# Altium project final-project.PrjPCB
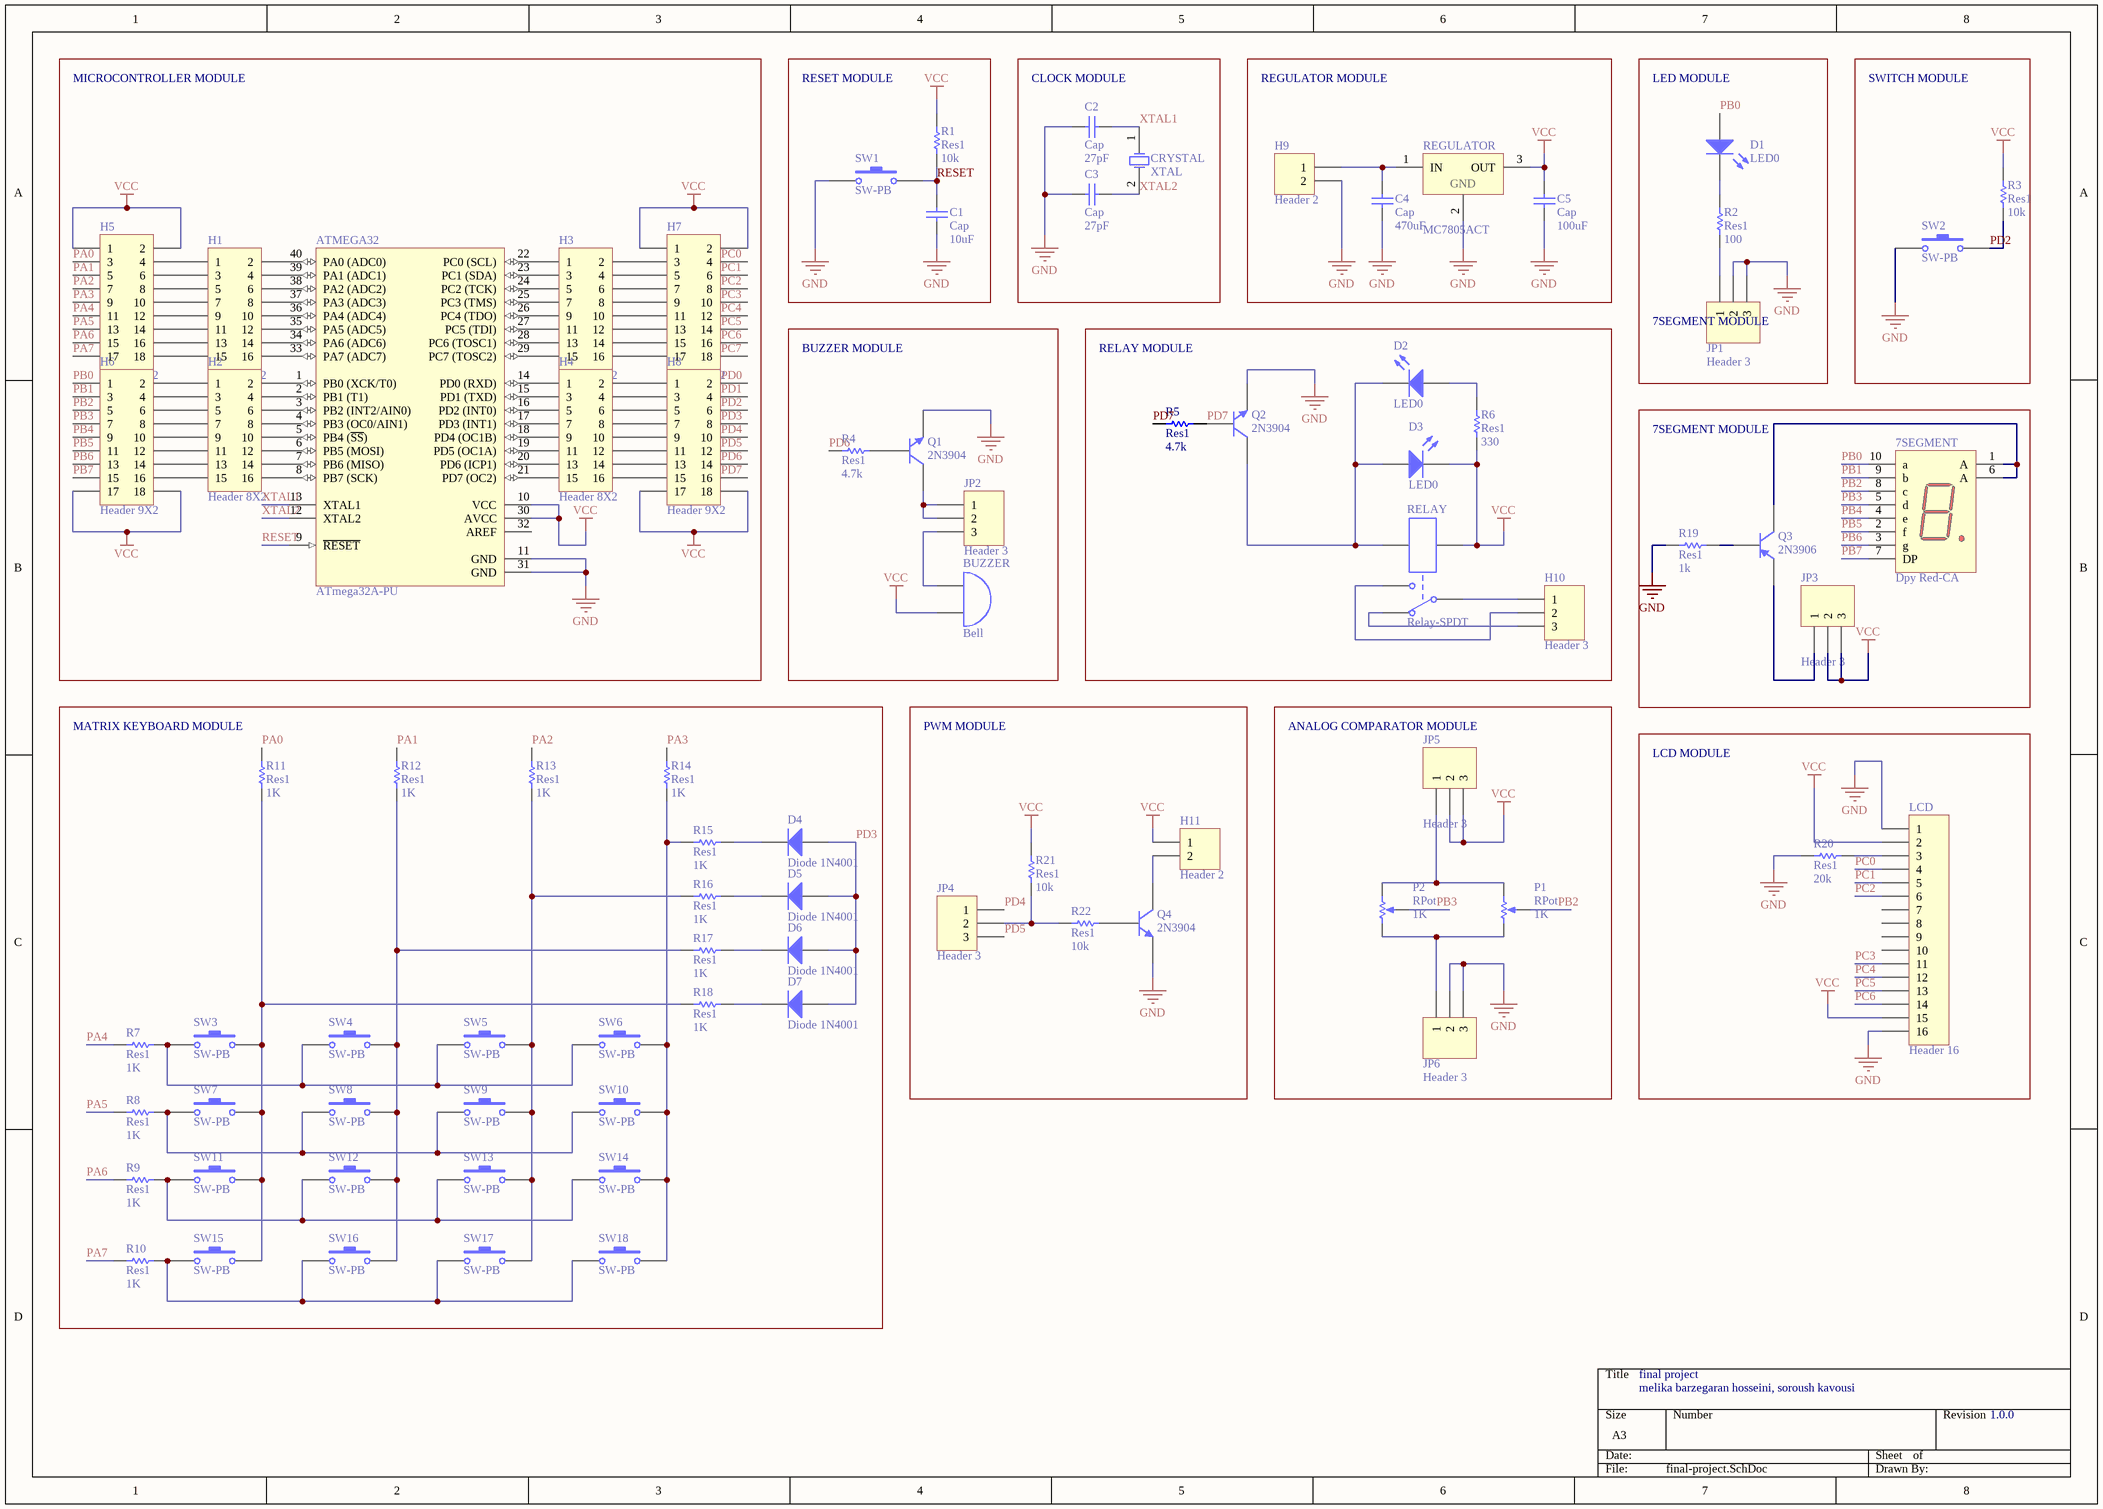
[diagram p0: final-project.SchDoc]
1 sheet, 82 parts. Net scope: global (net labels, ports and power ports of the same name join across sheets).
Board file: final-project.PcbDoc

## Sheet final-project.SchDoc: final project
size A3; Author: melika barzegaran hosseini, soroush kavousi; Revision: 1.0.0

### Parts
7SEGMENT  Dpy Red-CA  [LEDDIP-10/C5.08RHD]
ATMEGA32  ATmega32A-PU  [40P6]
BUZZER  Bell  [PIN2]
C1  Cap  value 10uF  [RAD-0.3]
C2  Cap  value 27pF  [RAD-0.3]
C3  Cap  value 27pF  [RAD-0.3]
C4  Cap  value 470uF  [RAD-0.3]
C5  Cap  value 100uF  [RAD-0.3]
CRYSTAL  XTAL  [BCY-W2/D3.1]
D1  LED0  [RB5-10.5]
D2  LED0  [RB5-10.5]
D3  LED0  [RB5-10.5]
D4  Diode 1N4001  [DIO10.46-5.3x2.8]
D5  Diode 1N4001  [DIO10.46-5.3x2.8]
D6  Diode 1N4001  [DIO10.46-5.3x2.8]
D7  Diode 1N4001  [DIO10.46-5.3x2.8]
H1  Header 8X2  [HDR1X8]
H2  Header 8X2  [HDR1X8]
H3  Header 8X2  [HDR1X8]
H4  Header 8X2  [HDR1X8]
H5  Header 9X2  [HDR1X9]
H6  Header 9X2  [HDR1X9]
H7  Header 9X2  [HDR1X9]
H8  Header 9X2  [HDR1X9]
H9  Header 2  [HDR1X2]
H10  Header 3  [HDR1X3]
H11  Header 2  [HDR1X2]
JP1  Header 3  [HDR1X3]
JP2  Header 3  [HDR1X3]
JP3  Header 3  [HDR1X3]
JP4  Header 3  [HDR1X3]
JP5  Header 3  [HDR1X3]
JP6  Header 3  [HDR1X3]
LCD  Header 16  [HDR1X16]
P1  RPot  value 1K  [VR5]
P2  RPot  value 1K  [VR5]
Q1  2N3904  [HDR1X3]
Q2  2N3904  [HDR1X3]
Q3  2N3906  [HDR1X3]
Q4  2N3904  [HDR1X3]
R1  Res1  value 10k  [AXIAL-0.3]
R2  Res1  value 100  [AXIAL-0.3]
R3  Res1  value 10k  [AXIAL-0.3]
R4  Res1  value 4.7k  [AXIAL-0.3]
R5  Res1  value 4.7k  [AXIAL-0.3]
R6  Res1  value 330  [AXIAL-0.3]
R7  Res1  value 1K  [AXIAL-0.3]
R8  Res1  value 1K  [AXIAL-0.3]
R9  Res1  value 1K  [AXIAL-0.3]
R10  Res1  value 1K  [AXIAL-0.3]
R11  Res1  value 1K  [AXIAL-0.3]
R12  Res1  value 1K  [AXIAL-0.3]
R13  Res1  value 1K  [AXIAL-0.3]
R14  Res1  value 1K  [AXIAL-0.3]
R15  Res1  value 1K  [AXIAL-0.3]
R16  Res1  value 1K  [AXIAL-0.3]
R17  Res1  value 1K  [AXIAL-0.3]
R18  Res1  value 1K  [AXIAL-0.3]
R19  Res1  value 1k  [AXIAL-0.3]
R20  Res1  value 20k  [AXIAL-0.3]
R21  Res1  value 10k  [AXIAL-0.3]
R22  Res1  value 10k  [AXIAL-0.3]
REGULATOR  MC7805ACT  [221A-04]
RELAY  Relay-SPDT  [DIP-P5/X1.65]
SW1  SW-PB  [SPST-2]
SW2  SW-PB  [SPST-2]
SW3  SW-PB  [SPST-2]
SW4  SW-PB  [SPST-2]
SW5  SW-PB  [SPST-2]
SW6  SW-PB  [SPST-2]
SW7  SW-PB  [SPST-2]
SW8  SW-PB  [SPST-2]
SW9  SW-PB  [SPST-2]
SW10  SW-PB  [SPST-2]
SW11  SW-PB  [SPST-2]
SW12  SW-PB  [SPST-2]
SW13  SW-PB  [SPST-2]
SW14  SW-PB  [SPST-2]
SW15  SW-PB  [SPST-2]
SW16  SW-PB  [SPST-2]
SW17  SW-PB  [SPST-2]
SW18  SW-PB  [SPST-2]

### Blocks framed on the sheet
MICROCONTROLLER MODULE: ATMEGA32 H1-H8
RESET MODULE: C1 R1 SW1
CLOCK MODULE: C2 C3 CRYSTAL
REGULATOR MODULE: C4 C5 H9 REGULATOR
SWITCH MODULE: R3 SW2
BUZZER MODULE: BUZZER JP2 Q1 R4
RELAY MODULE: D2 D3 H10 Q2 R5 R6 RELAY
7SEGMENT MODULE: 7SEGMENT JP3 Q3 R19
MATRIX KEYBOARD MODULE: D4-D7 R7-R18 SW3-SW18
PWM MODULE: H11 JP4 Q4 R21 R22
ANALOG COMPARATOR MODULE: JP5 JP6 P1 P2
LCD MODULE: LCD R20

### Nets
GND: ATMEGA32.11(GND) ATMEGA32.31(GND) C1.1 C2.1 C3.1 C4.1 C5.1 H9.2 JP1.2 JP1.3 JP6.2 JP6.3 LCD.1 LCD.16 Q1.1(E) Q2.1(E) Q4.1(E) R19.1 R20.1 REGULATOR.2(GND) SW1.1 SW2.1
VCC: ATMEGA32.10(VCC) ATMEGA32.30(AVCC) BUZZER.2(B) C5.2 D3.2(K) H5.1 H5.2 H6.17 H6.18 H7.1 H7.2 H8.17 H8.18 H11.1 JP3.2 JP3.3 JP5.2 JP5.3 LCD.2 LCD.15 R1.2 R3.2 R6.1 R21.2 REGULATOR.3(OUT) RELAY.4
PA0: H5.3 R11.2
PA1: H5.5 R12.2
PA2: H5.7 R13.2
PA3: H5.9 R14.2
PA4: H5.11 R7.1
PA5: H5.13 R8.1
PA6: H5.15 R9.1
PA7: H5.17 R10.1
PB0: 7SEGMENT.10(a) D1.1(A) H6.1
PB1: 7SEGMENT.9(b) H6.3
PB2: 7SEGMENT.8(c) H6.5 P1.3(TAP)
PB3: 7SEGMENT.5(d) H6.7 P2.3(TAP)
PB4: 7SEGMENT.4(e) H6.9
PB5: 7SEGMENT.2(f) H6.11
PB6: 7SEGMENT.3(g) H6.13
PB7: 7SEGMENT.7(DP) H6.15
PC0: LCD.4
PC1: LCD.5
PC2: LCD.6
PC3: LCD.11
PC4: LCD.12
PC5: LCD.13
PC6: LCD.14
PD2: R3.1 SW2.2
PD3: D4.1(A) D5.1(A) D6.1(A) D7.1(A)
PD4: JP4.1
PD5: JP4.3
PD6: R4.1
PD7: Q2.2(B) R5.1 R5.2
RESET: ATMEGA32.9(~{RESET}) C1.2 R1.1 SW1.2
XTAL1: ATMEGA32.13(XTAL1) C2.2 CRYSTAL.1(OSC1)
XTAL2: ATMEGA32.12(XTAL2) C3.2 CRYSTAL.2(OSC2)
Net7SEGMENT_1: 7SEGMENT.1(A) 7SEGMENT.6(A) Q3.3(C)
NetATMEGA32_1: ATMEGA32.1(PB0_(XCK/T0)) H2.2
NetATMEGA32_2: ATMEGA32.2(PB1_(T1)) H2.4
NetATMEGA32_3: ATMEGA32.3(PB2_(INT2/AIN0)) H2.6
NetATMEGA32_4: ATMEGA32.4(PB3_(OC0/AIN1)) H2.8
NetATMEGA32_5: ATMEGA32.5(PB4_(~{SS})) H2.10
NetATMEGA32_6: ATMEGA32.6(PB5_(MOSI)) H2.12
NetATMEGA32_7: ATMEGA32.7(PB6_(MISO)) H2.14
NetATMEGA32_8: ATMEGA32.8(PB7_(SCK)) H2.16
NetATMEGA32_14: ATMEGA32.14(PD0_(RXD)) H4.1
NetATMEGA32_15: ATMEGA32.15(PD1_(TXD)) H4.3
NetATMEGA32_16: ATMEGA32.16(PD2_(INT0)) H4.5
NetATMEGA32_17: ATMEGA32.17(PD3_(INT1)) H4.7
NetATMEGA32_18: ATMEGA32.18(PD4_(OC1B)) H4.9
NetATMEGA32_19: ATMEGA32.19(PD5_(OC1A)) H4.11
NetATMEGA32_20: ATMEGA32.20(PD6_(ICP1)) H4.13
NetATMEGA32_21: ATMEGA32.21(PD7_(OC2)) H4.15
NetATMEGA32_22: ATMEGA32.22(PC0_(SCL)) H3.1
NetATMEGA32_23: ATMEGA32.23(PC1_(SDA)) H3.3
NetATMEGA32_24: ATMEGA32.24(PC2_(TCK)) H3.5
NetATMEGA32_25: ATMEGA32.25(PC3_(TMS)) H3.7
NetATMEGA32_26: ATMEGA32.26(PC4_(TDO)) H3.9
NetATMEGA32_27: ATMEGA32.27(PC5_(TDI)) H3.11
NetATMEGA32_28: ATMEGA32.28(PC6_(TOSC1)) H3.13
NetATMEGA32_29: ATMEGA32.29(PC7_(TOSC2)) H3.15
NetATMEGA32_33: ATMEGA32.33(PA7_(ADC7)) H1.16
NetATMEGA32_34: ATMEGA32.34(PA6_(ADC6)) H1.14
NetATMEGA32_35: ATMEGA32.35(PA5_(ADC5)) H1.12
NetATMEGA32_36: ATMEGA32.36(PA4_(ADC4)) H1.10
NetATMEGA32_37: ATMEGA32.37(PA3_(ADC3)) H1.8
NetATMEGA32_38: ATMEGA32.38(PA2_(ADC2)) H1.6
NetATMEGA32_39: ATMEGA32.39(PA1_(ADC1)) H1.4
NetATMEGA32_40: ATMEGA32.40(PA0_(ADC0)) H1.2
NetBUZZER_1: BUZZER.1(A) JP2.3
NetC4_2: C4.2 H9.1 REGULATOR.1(IN)
NetD1_2: D1.2(K) R2.2
NetD2_1: D2.1(A) R6.2
NetD2_2: D2.2(K) D3.1(A) Q2.3(C) RELAY.5
NetD4_2: D4.2(K) R15.2
NetD5_2: D5.2(K) R16.2
NetD6_2: D6.2(K) R17.2
NetD7_2: D7.2(K) R18.2
NetH1_1: H1.1 H5.4
NetH1_3: H1.3 H5.6
NetH1_5: H1.5 H5.8
NetH1_7: H1.7 H5.10
NetH1_9: H1.9 H5.12
NetH1_11: H1.11 H5.14
NetH1_13: H1.13 H5.16
NetH1_15: H1.15 H5.18
NetH2_1: H2.1 H6.2
NetH2_3: H2.3 H6.4
NetH2_5: H2.5 H6.6
NetH2_7: H2.7 H6.8
NetH2_9: H2.9 H6.10
NetH2_11: H2.11 H6.12
NetH2_13: H2.13 H6.14
NetH2_15: H2.15 H6.16
NetH3_2: H3.2 H7.3
NetH3_4: H3.4 H7.5
NetH3_6: H3.6 H7.7
NetH3_8: H3.8 H7.9
NetH3_10: H3.10 H7.11
NetH3_12: H3.12 H7.13
NetH3_14: H3.14 H7.15
NetH3_16: H3.16 H7.17
NetH4_2: H4.2 H8.1
NetH4_4: H4.4 H8.3
NetH4_6: H4.6 H8.5
NetH4_8: H4.8 H8.7
NetH4_10: H4.10 H8.9
NetH4_12: H4.12 H8.11
NetH4_14: H4.14 H8.13
NetH4_16: H4.16 H8.15
NetH10_1: H10.1 RELAY.1
NetH10_2: H10.2 RELAY.3
NetH10_3: H10.3 RELAY.2
NetH11_2: H11.2 Q4.3(C)
NetJP1_1: JP1.1 R2.1
NetJP2_1: JP2.1 JP2.2 Q1.3(C)
NetJP3_1: JP3.1 Q3.1(E)
NetJP4_2: JP4.2 R21.1 R22.1
NetJP5_1: JP5.1 P1.2(BOT) P2.2(BOT)
NetJP6_1: JP6.1 P1.1(TOP) P2.1(TOP)
NetLCD_3: LCD.3 R20.2
NetQ1_2: Q1.2(B) R4.2
NetQ3_2: Q3.2(B) R19.2
NetQ4_2: Q4.2(B) R22.2
NetR7_2: R7.2 SW3.1 SW4.1 SW5.1 SW6.1
NetR8_2: R8.2 SW7.1 SW8.1 SW9.1 SW10.1
NetR9_2: R9.2 SW11.1 SW12.1 SW13.1 SW14.1
NetR10_2: R10.2 SW15.1 SW16.1 SW17.1 SW18.1
NetR11_1: R11.1 R18.1 SW3.2 SW7.2 SW11.2 SW15.2
NetR12_1: R12.1 R17.1 SW4.2 SW8.2 SW12.2 SW16.2
NetR13_1: R13.1 R16.1 SW5.2 SW9.2 SW13.2 SW17.2
NetR14_1: R14.1 R15.1 SW6.2 SW10.2 SW14.2 SW18.2

Not connected (* = marked no-connect by the designer): ATMEGA32 32(AREF); H7 4 6 8 10 12 14 16 18; H8 2 4 6 8 10 12 14 16; LCD 7 8 9 10

### Notes on the sheet
- LED MODULE
- (near JP1) 7SEGMENT MODULE
- Labels drawn without touching a wire or pin: PC0, PC1, PC2, PC3, PC4, PC5, PC6, PC7, PD0, PD1, PD2, PD3, PD4, PD5, PD6, PD7

### Library data of the parts
7SEGMENT = Dpy Red-CA: 7.62 mm Black Surface HER 7-Segment Display: CA, RH DP; MinimumIntensity: 360 ucd; Note: IF = 5 mA; Note: Pins 1 and 6 are redundant Anodes.; Published: 8-Jun-2000; LatestRevisionDate: 17-Dec-2003; LatestRevisionNote: Schematic revised, PCB Footprint replaced.; DatasheetVersion: 19-Feb-2002; PackageVersion: 19-Feb-2002; PackageReference: LEDDIP-10; Publisher: Altium Limited; Colour: High Efficiency Red (HER); ComponentLink1Description: Manufacturer Link; ComponentLink1URL: http://www.agilent.com/
ATMEGA32 = ATmega32A-PU: 8-bit AVR Microcontroller, 32KB Flash, 1KB EEPROM, 2KB SRAM, 40-pin PDIP, Industrial Grade (-40°C to 85°C); Published: 1-Apr-2010; DatasheetVersion: revB, Jul-2009; PackageVersion: revB, Sep-2001; PackageReference: 40P6; Publisher: Altium Limited; PackageDescription: 40-lead (0.600"/15.24mm Wide) Plastic Dual Inline Package (PDIP); Supplier 1: Digi-Key; Supplier Part Number 1: ATMEGA32A-PU-ND; Supplier 2: Farnell; Supplier Part Number 2: 1704565; Supplier 3: Mouser; Supplier Part Number 3: 556-ATMEGA32A-PU; Code_JEDEC: MS-011-AC; ComponentLink1Description: Manufacturer Link; ComponentLink1URL: http://www.atmel.com/products/avr/default.asp?; ComponentLink2Description: ATmega32A Datasheet; ComponentLink2URL: http://www.atmel.com/dyn/resources/prod_documents/doc8155.pdf; ComponentLink3Description: ATmega32A Summary; ComponentLink3URL: http://www.atmel.com/dyn/resources/prod_documents/8155S.pdf; ComponentLink4Description: Atmel.com Home; ComponentLink4URL: http://www.atmel.com
BUZZER = Bell: Electrical Bell; Published: 24-Mar-1999; LatestRevisionDate: 17-Jul-2002; LatestRevisionNote: Re-released for DXP Platform.; PackageReference: PIN2; Publisher: Altium Limited
C1-C5 = Cap: Capacitor; Published: 8-Jun-2000; LatestRevisionDate: 17-Jul-2002; LatestRevisionNote: Re-released for DXP Platform.; PackageReference: RAD-0.3; Publisher: Altium Limited
CRYSTAL = XTAL: Crystal Oscillator; Published: 8-Jun-2000; LatestRevisionDate: 17-Jul-2002; LatestRevisionNote: Re-released for DXP Platform.; PackageReference: R38; Publisher: Altium Limited
D1-D3 = LED0: Typical INFRARED GaAs LED; Published: 8-Jun-2000; LatestRevisionDate: 08-Jul-2005; LatestRevisionNote: Mech Layer 1 removed.; PackageReference: LED-0; Publisher: Altium Limited
D4-D7 = Diode 1N4001: 1 Amp General Purpose Rectifier; Published: 8-Jun-2000; LatestRevisionDate: 17-Jul-2002; LatestRevisionNote: Re-released for DXP Platform.; DatasheetVersion: 1998; PackageVersion: Aug-1999; PackageReference: DO-41; Publisher: Altium Limited; Code_JEDEC: DO-204-AL; ComponentLink1Description: Manufacturer Link; ComponentLink1URL: http://www.fairchildsemi.com/; ComponentLink2Description: Datasheet; ComponentLink2URL: http://www.fairchildsemi.com/ds/1N%2F1N4001.pdf
H1-H4 = Header 8X2: Header, 8-Pin, Dual row; LatestRevisionDate: 17-Jul-2002; LatestRevisionNote: Re-released for DXP Platform.; Publisher: Altium Limited
H5-H8 = Header 9X2: Header, 9-Pin, Dual row; LatestRevisionDate: 17-Jul-2002; LatestRevisionNote: Re-released for DXP Platform.; Publisher: Altium Limited
H9 H11 = Header 2: Header, 2-Pin; LatestRevisionDate: 17-Jul-2002; LatestRevisionNote: Re-released for DXP Platform.; Publisher: Altium Limited
H10 JP1-JP6 = Header 3: Header, 3-Pin; LatestRevisionDate: 17-Jul-2002; LatestRevisionNote: Re-released for DXP Platform.; Publisher: Altium Limited
LCD = Header 16: Header, 16-Pin; LatestRevisionDate: 17-Jul-2002; LatestRevisionNote: Re-released for DXP Platform.; Publisher: Altium Limited
P1 P2 = RPot: Potentiometer; Sim Note: Enter the Resistance value and the set point into parameter fields.; Set Position: 0.5; Published: 8-Jun-2000; LatestRevisionDate: 17-Jul-2002; LatestRevisionNote: Re-released for DXP Platform.; PackageReference: VR5; Publisher: Altium Limited
Q1 Q2 Q4 = 2N3904: NPN General Purpose Amplifier; Published: 8-Jun-2000; LatestRevisionDate: 15-Jan-2003; LatestRevisionNote: PCB Footprint 'BCY-W3/D4.7' replaced; DatasheetVersion: 1997; PackageVersion: Sep-1998; PackageReference: TO-92A; Publisher: Altium Limited; Code_JEDEC: TO-92A; ComponentLink1Description: Manufacturer Link; ComponentLink1URL: http://www.fairchildsemi.com/; ComponentLink2Description: Datasheet; ComponentLink2URL: http://www.fairchildsemi.com/ds/2N%2F2N3904.pdf
Q3 = 2N3906: PNP General Purpose Amplifier; Published: 8-Jun-2000; LatestRevisionDate: 15-Jan-2003; LatestRevisionNote: PCB Footprint 'BCY-W3/D4.7' replaced; DatasheetVersion: 1997; PackageVersion: Sep-1998; PackageReference: TO-92A; Publisher: Altium Limited; Code_JEDEC: TO-92A; ComponentLink1Description: Manufacturer Link; ComponentLink1URL: http://www.fairchildsemi.com/; ComponentLink2Description: Datasheet; ComponentLink2URL: http://www.fairchildsemi.com/ds/2N%2F2N3906.pdf
R1-R22 = Res1: Resistor; Published: 8-Jun-2000; LatestRevisionDate: 17-Jul-2002; LatestRevisionNote: Re-released for DXP Platform.; PackageReference: AXIAL-0.3; Publisher: Altium Limited
REGULATOR = MC7805ACT: 3-Terminal Positive Fixed Voltage Regulator; Note: Pin 2 is electrically connected to TAB; Published: 17-Jul-2002; DatasheetVersion: 1988; PackageReference: 221A-04; Publisher: Altium Limited; PackageDescription: TO, Thru-Hole, Vertical, Heatsink Mounted; 3 In-Line Leads; Pitch 2.54 mm; Code_JEDEC: TO-262-AA; ComponentLink1Description: Manufacturer Link; ComponentLink1URL: http://www.onsemi.com/site/products/taxonomy/0,4438,503,00.html; ComponentLink2Description: Datasheet; ComponentLink2URL: http://www.onsemi.com/pub/Collateral/MC7800-D.PDF
RELAY = Relay-SPDT: Single-Pole Dual-Throw Relay; Published: 24-Mar-1999; LatestRevisionDate: 17-Jul-2002; LatestRevisionNote: Re-released for DXP Platform.; PackageReference: MODULE5B; Publisher: Altium Limited
SW1-SW18 = SW-PB: Switch; Published: 24-Mar-1999; LatestRevisionDate: 17-Jul-2002; LatestRevisionNote: Re-released for DXP Platform.; PackageReference: SPST-2; Publisher: Altium Limited